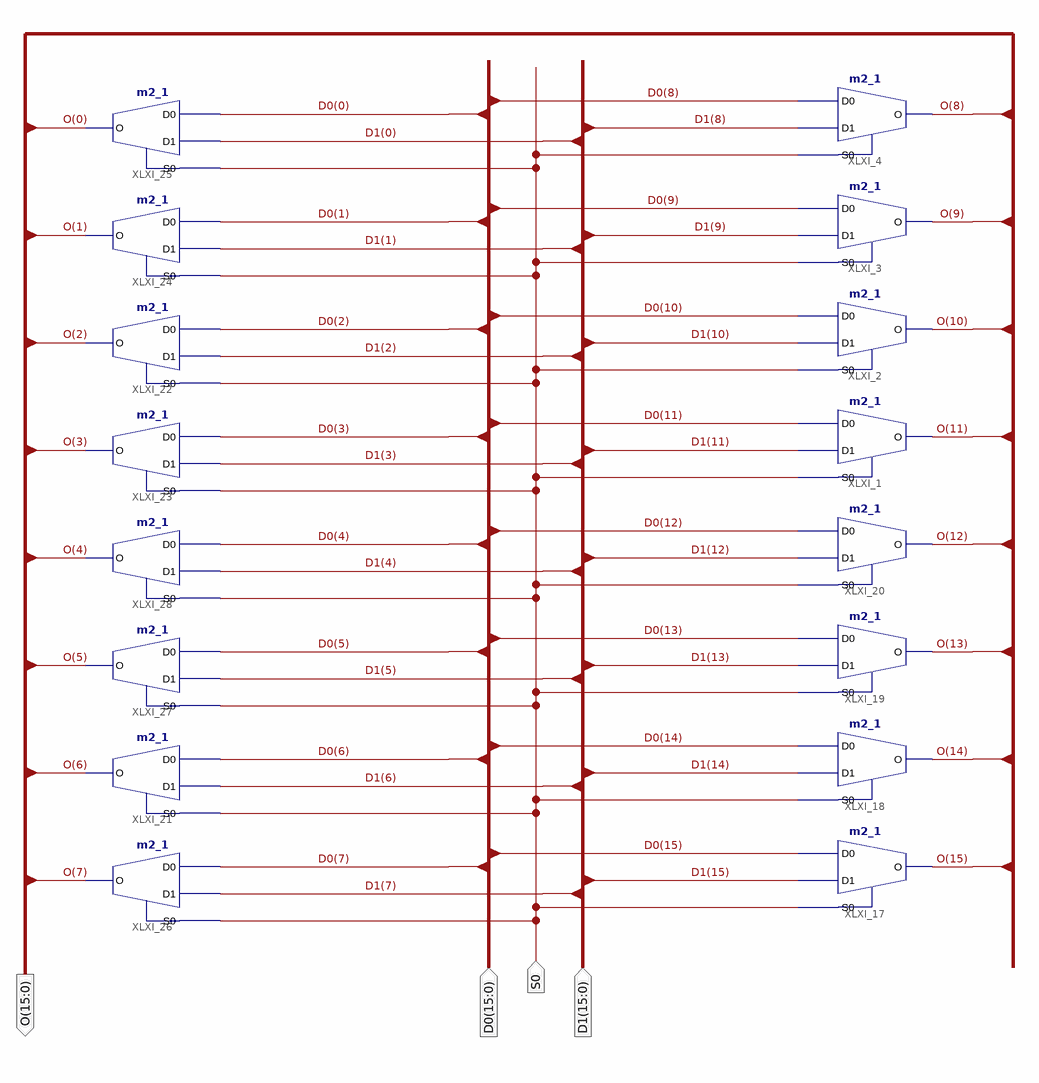
[diagram p0: schematic sheet 1]
// Xilinx ISE schematic mux2x16.sch (spartan3e) as structural Verilog: 16 symbols, 4 ports
module mux2x16 (
  input  S0,
  input  [15:0] D1,
  input  [15:0] D0,
  output [15:0] O
);

  m2_1 XLXI_25 (.D0(D0[0]), .D1(D1[0]), .S0(S0), .O(O[0]));
  m2_1 XLXI_24 (.D0(D0[1]), .D1(D1[1]), .S0(S0), .O(O[1]));
  m2_1 XLXI_22 (.D0(D0[2]), .D1(D1[2]), .S0(S0), .O(O[2]));
  m2_1 XLXI_23 (.D0(D0[3]), .D1(D1[3]), .S0(S0), .O(O[3]));
  m2_1 XLXI_28 (.D0(D0[4]), .D1(D1[4]), .S0(S0), .O(O[4]));
  m2_1 XLXI_27 (.D0(D0[5]), .D1(D1[5]), .S0(S0), .O(O[5]));
  m2_1 XLXI_21 (.D0(D0[6]), .D1(D1[6]), .S0(S0), .O(O[6]));
  m2_1 XLXI_26 (.D0(D0[7]), .D1(D1[7]), .S0(S0), .O(O[7]));
  m2_1 XLXI_18 (.D0(D0[14]), .D1(D1[14]), .S0(S0), .O(O[14]));
  m2_1 XLXI_2 (.D0(D0[10]), .D1(D1[10]), .S0(S0), .O(O[10]));
  m2_1 XLXI_1 (.D0(D0[11]), .D1(D1[11]), .S0(S0), .O(O[11]));
  m2_1 XLXI_3 (.D0(D0[9]), .D1(D1[9]), .S0(S0), .O(O[9]));
  m2_1 XLXI_4 (.D0(D0[8]), .D1(D1[8]), .S0(S0), .O(O[8]));
  m2_1 XLXI_17 (.D0(D0[15]), .D1(D1[15]), .S0(S0), .O(O[15]));
  m2_1 XLXI_19 (.D0(D0[13]), .D1(D1[13]), .S0(S0), .O(O[13]));
  m2_1 XLXI_20 (.D0(D0[12]), .D1(D1[12]), .S0(S0), .O(O[12]));
endmodule
